# EAGLE schematic ai_breakout_oled-0.96 (EAGLE 7.1.0)
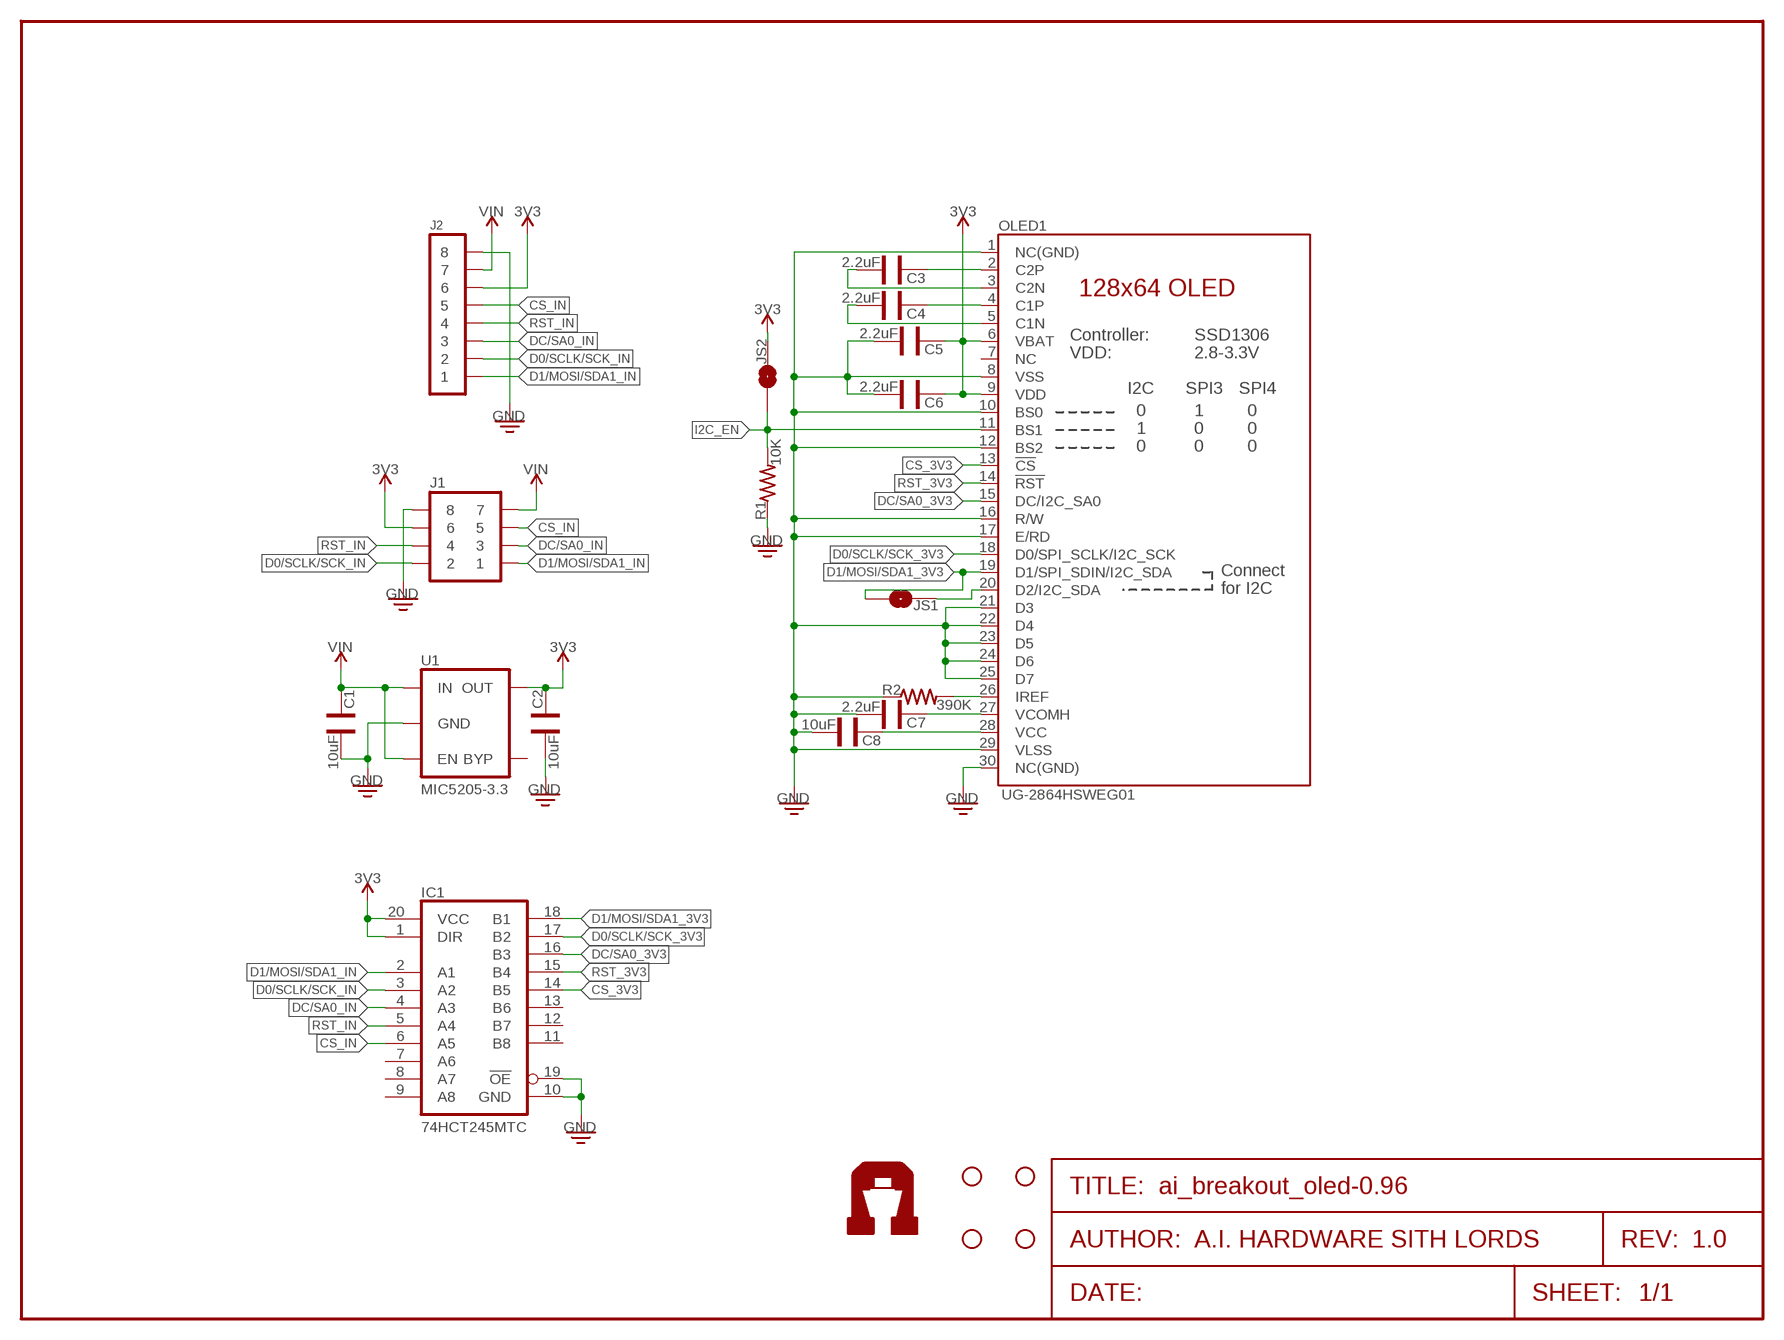
[diagram p0: schematic, sheet 1]
FRAME1 (FRAME-LETTER): AUTHOR: A.I. HARDWARE SITH LORDS; REV: 1.0

## Parts
C1  10uF  CAP0603  [CAP-0603]
C2  10uF  CAP0603  [CAP-0603]
C3  2.2uF  CAP0603  [CAP-0603]
C4  2.2uF  CAP0603  [CAP-0603]
C5  2.2uF  CAP0603  [CAP-0603]
C6  2.2uF  CAP0603  [CAP-0603]
C7  2.2uF  CAP0603  [CAP-0603]
C8  10uF  CAP0603  [CAP-0603]
IC1  74HCT245MTC  [SSOP20]
J1  2X04  [2X04]
J2  1X08  [1X08]
JS1  1X02-SJ-NO  [1X02-SJ-NO]
JS2  1X02-SJ-NO  [1X02-SJ-NO]
M1  STAND-OFF  [STAND-OFF]
M2  STAND-OFF  [STAND-OFF]
M3  STAND-OFF  [STAND-OFF]
M4  STAND-OFF  [STAND-OFF]
OLED1  UG-2864HSWEG01  UG-2864HSWEG01-0.96  [UG-2864HSWEG01_0.96_WRAP]
R1  10K  RES0603  [RES-0603]
R2  390K  RES0603  [RES-0603]
U1  MIC5205-3.3  [SOT23-5]
U$15  AI-LOGOXS  [AI-LOGO-XS]
U$16  AI-LOGOXS  [AI-LOGO-XS]

## Nets
3V3: C2.2 C5.2 C6.2 IC1.1(DIR) IC1.20(VCC) J1.6 J2.6 JS2.2 OLED1.6(VBAT) OLED1.9(VDD) U1.5(OUT)
CS_3V3: IC1.14(B5) OLED1.13(!CS)
CS_IN: IC1.6(A5) J1.5 J2.5
D0/SCLK/SCK_3V3: IC1.17(B2) OLED1.18(D0/SPI_SCLK/I2C_SCK)
D0/SCLK/SCK_IN: IC1.3(A2) J1.2 J2.2
D1/MOSI/SDA1_3V3: IC1.18(B1) JS1.1 OLED1.19(D1/SPI_SDIN/I2C_SDA)
D1/MOSI/SDA1_IN: IC1.2(A1) J1.1 J2.1
DC/SA0_3V3: IC1.16(B3) OLED1.15(DC/I2C_SA0)
DC/SA0_IN: IC1.4(A3) J1.3 J2.3
GND: C1.1 C2.1 C5.1 C6.1 C7.1 C8.1 IC1.10(GND) IC1.19(!OE) J1.8 J2.8 OLED1.1(NC(GND)) OLED1.8(VSS) OLED1.10(BS0) OLED1.12(BS2) OLED1.16(R/W) OLED1.17(E/RD) OLED1.21(D3) OLED1.22(D4) OLED1.23(D5) OLED1.24(D6) OLED1.25(D7) OLED1.29(VLSS) OLED1.30(NC(GND)) R1.1 R2.1 U1.2(GND)
I2C_EN: JS2.1 OLED1.11(BS1) R1.2
N$3: OLED1.26(IREF) R2.2
N$4: C3.2 OLED1.2(C2P)
N$5: C3.1 OLED1.3(C2N)
N$6: C4.2 OLED1.4(C1P)
N$7: C4.1 OLED1.5(C1N)
N$8: JS1.2 OLED1.20(D2/I2C_SDA)
N$11: C8.2 OLED1.28(VCC)
N$12: C7.2 OLED1.27(VCOMH)
RST_3V3: IC1.15(B4) OLED1.14(!RST)
RST_IN: IC1.5(A4) J1.4 J2.4
VIN: C1.2 J1.7 J2.7 U1.1(IN) U1.3(EN)
Unconnected: IC1.7(A6) IC1.8(A7) IC1.9(A8) IC1.11(B8) IC1.12(B7) IC1.13(B6) OLED1.7(NC) U1.4(BYP)

## Library data of the parts
C1-C8 = Ai_Passives:CAP
IC1 = Ai_IC:74HCT245: Octal BUS TRANSCEIVER, 3-state
J1 = Ai_Connectors:2X04
J2 = Ai_Connectors:1X08
JS1 JS2 = Ai_Connectors:1X02-SJ-NO: Solder Jumper SMD solder jumper: Normally Open and Normally Closed are the same, but have different paste layers. NC will have a large amount of paste and should jumper during reflow.
M1-M4 = Ai_Electromechanical:STAND-OFF: #4 Stand Off This is the mechanical footprint for a #4 phillips button head screw. Use the keepout ring to avoid running the screw head into surrounding components.
OLED1 = Ai_Displays:UG-2864HSWEG01: UG-2864HSWEG01 OLED display Both 1.3" and 0.96" models share the same FPC tab footprint, only the screen dimensions vary.
R1 R2 = Ai_Passives:RES: Part # blah Digikey
U1 = Ai_Power:MIC5205-*: Fixed-Voltage Regulator Standard voltage regulator in SOT23-5 layout. Micrel part MIC5205x.x where x.x designates the output voltage (e.g., 3.3). BYP pin is used to lower output noise with 470pF cap. Haven't tested the footprint on an actual board yet!
U$15 U$16 = Ai_Miscellany:AI-LOGO